# Altium project Placa_ADA.PrjPcb
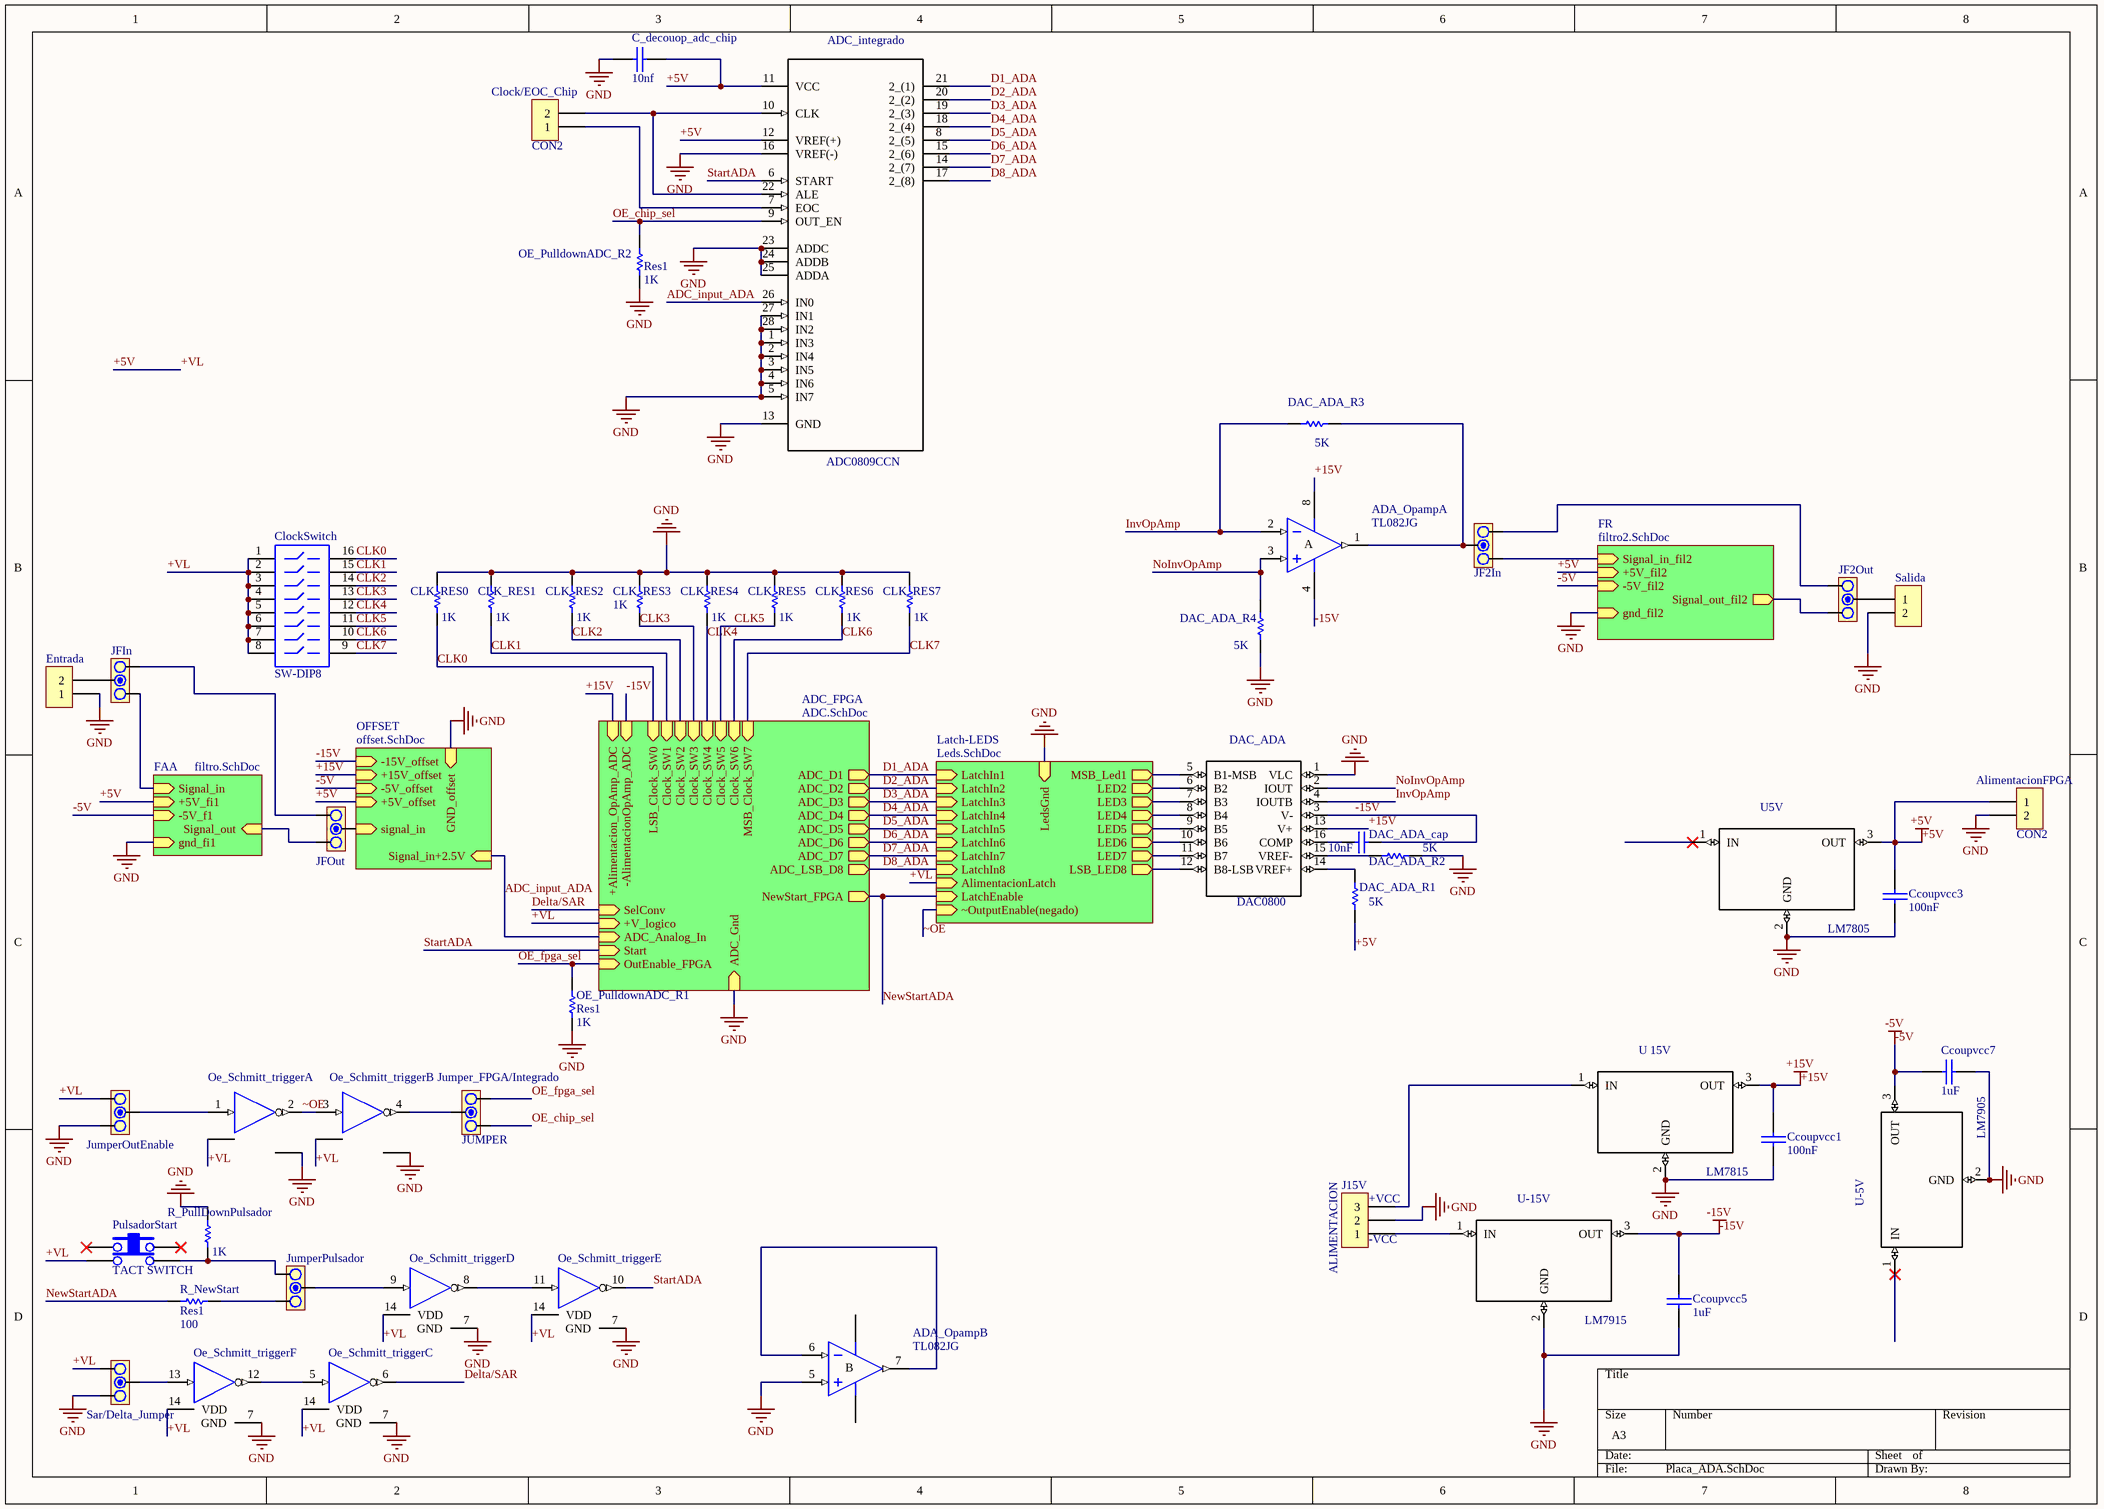
[diagram p0: Placa_ADA.SchDoc]
6 sheets, 139 parts. Net scope: hierarchical (ports join the sheet entries above them; power ports are global).
Board file: ADA.PcbDoc
Sheets:
  Placa_ADA.SchDoc
    ADC_FPGA = ADC.SchDoc
    Latch-LEDS = Leds.SchDoc
    FAA = filtro.SchDoc
    OFFSET = offset.SchDoc
    FR = filtro2.SchDoc

## Sheet Placa_ADA.SchDoc
size A3

### Parts
ADA_Opamp  TL082JG  [JG008]  (parts A,B of 2)
ADC_integrado  ADC0809CCN  [*DIP254P1524X483-28]
AlimentacionFPGA  CON2  [SIP2]
C_decouop_adc_chip  10nf  [CAP200]
Ccoupvcc1  100nF  [CAP200]
Ccoupvcc3  100nF  [CAP200]
Ccoupvcc5  1uF  [CAP200]
Ccoupvcc7  1uF  [CAP200]
CLK_RES0  value 1K  [AXIAL-0.3]  (hidden comment: Res1)
CLK_RES1  value 1K  [AXIAL-0.3]  (hidden comment: Res1)
CLK_RES2  value 1K  [AXIAL-0.3]  (hidden comment: Res1)
CLK_RES3  value 1K  [AXIAL-0.3]  (hidden comment: Res1)
CLK_RES4  value 1K  [AXIAL-0.3]  (hidden comment: Res1)
CLK_RES5  value 1K  [AXIAL-0.3]  (hidden comment: Res1)
CLK_RES6  value 1K  [AXIAL-0.3]  (hidden comment: Res1)
CLK_RES7  value 1K  [AXIAL-0.3]  (hidden comment: Res1)
Clock/EOC_Chip  CON2  [SIP2]
ClockSwitch  SW-DIP8  [DIP-16-KEY]
DAC_ADA  DAC0800  [*DIL16]
DAC_ADA_cap  value 10nF  [RAD-0.3]  (hidden comment: Cap)
DAC_ADA_R1  value 5K  [AXIAL-0.3]  (hidden comment: Res1)
DAC_ADA_R2  value 5K  [AXIAL-0.3]  (hidden comment: Res1)
DAC_ADA_R3  value 5K  [AXIAL-0.3]  (hidden comment: Res1)
DAC_ADA_R4  value 5K  [AXIAL-0.3]  (hidden comment: Res1)
Entrada  BORNERA 2  [BORNERA2]  (value not drawn)
J15V  ALIMENTACION  [BORNERA3]
JF2In  JUMPER  [JUMPER3]  (value not drawn)
JF2Out  JUMPER  [JUMPER3]  (value not drawn)
JFIn  JUMPER  [JUMPER3]  (value not drawn)
JFOut  JUMPER  [JUMPER3]  (value not drawn)
Jumper_FPGA/Integrado  JUMPER  [JUMPER3]
JumperOutEnable  JUMPER  [JUMPER3]  (value not drawn)
JumperPulsador  JUMPER  [JUMPER3]  (value not drawn)
OE_PulldownADC_R1  Res1  value 1K  [AXIAL-0.3]
OE_PulldownADC_R2  Res1  value 1K  [AXIAL-0.3]
Oe_Schmitt_trigger  MC74HC14AN  [646-06]  (value not drawn)  (parts A,B,C,D,E,F of 6)
PulsadorStart  TACT SWITCH  [TACTSWITCH]
R_NewStart  Res1  value 100  [AXIAL-0.3]
R_PullDownPulsador  value 1K  [AXIAL-0.3]  (hidden comment: Res1)
Salida  BORNERA 2  [BORNERA2]  (value not drawn)
Sar/Delta_Jumper  JUMPER  [JUMPER3]  (value not drawn)
U5V  LM7805  [*TO220]
U-5V  LM7905  [*TO220]
U-15V  LM7915  [*TO220]
U_15V  LM7815  [*TO220]

### Sub-sheets
ADC_FPGA = ADC.SchDoc: +V_logico (in), Clock_SW1 (in), Clock_SW2 (in), Clock_SW3 (in), Clock_SW4 (in), Clock_SW6 (in), LSB_Clock_SW0 (in), MSB_Clock_SW7 (in), ADC_Analog_In (in), Start (in), ADC_LSB_D8 (out), ADC_D7 (out), ADC_D6 (out), ADC_D5 (out), ADC_D4 (out), ADC_D3 (out), ADC_D2 (out), ADC_D1 (out), OutEnable_FPGA (in), ADC_Gnd (in), Clock_SW5 (in), NewStart_FPGA (out), SelConv (in), -AlimentacionOpAmp_ADC (in), +Alimentacion_OpAmp_ADC (in)
FAA = filtro.SchDoc: Signal_in (in), Signal_out (in), +5V_fi1 (in), -5V_f1 (in), gnd_fi1 (in)
FR = filtro2.SchDoc: Signal_in_fil2 (in), Signal_out_fil2 (out), +5V_fil2 (in), -5V_fil2 (in), gnd_fil2 (in)
Latch-LEDS = Leds.SchDoc: LatchIn1 (in), LatchIn2 (in), LatchIn3 (in), LatchIn4 (in), LatchIn5 (in), LatchIn6 (in), LatchIn7 (in), LatchIn8 (in), MSB_Led1 (out), LED2 (out), LED3 (out), LED4 (out), LED5 (out), LED6 (out), LED7 (out), LSB_LED8 (out), AlimentacionLatch (in), LatchEnable (in), LedsGnd (in), ~OutputEnable(negado) (in)
OFFSET = offset.SchDoc: -15V_offset (in), Signal_in+2.5V (in), +15V_offset (in), -5V_offset (in), +5V_offset (in), GND_offset (in), signal_in (in)

### Nets
+5V: ADC_integrado.11(VCC) ADC_integrado.12(VREF(+)) AlimentacionFPGA.1 C_decouop_adc_chip.2 Ccoupvcc3.1 ClockSwitch.1 ClockSwitch.2 ClockSwitch.3 ClockSwitch.4 ClockSwitch.5 ClockSwitch.6 ClockSwitch.7 ClockSwitch.8 DAC_ADA_R1.1 JumperOutEnable.3 Oe_Schmitt_trigger.14(VDD) PulsadorStart.2 Sar/Delta_Jumper.3 U5V.3(OUT) ; sheet ADC_FPGA/+V_logico, sheet Latch-LEDS/AlimentacionLatch, sheet FAA/+5V_fi1, sheet OFFSET/+5V_offset, sheet FR/+5V_fil2  [also labelled +VL, VDD]
+15V: ADA_Opamp.8(V+) Ccoupvcc1.1 DAC_ADA.13(V+) U_15V.3(OUT) ; sheet ADC_FPGA/+Alimentacion_OpAmp_ADC, sheet OFFSET/+15V_offset
-5V: Ccoupvcc7.1 U-5V.3(OUT) ; sheet FAA/-5V_f1, sheet OFFSET/-5V_offset, sheet FR/-5V_fil2
-15V: ADA_Opamp.4(V-) Ccoupvcc5.1 DAC_ADA.3(V-) DAC_ADA_cap.2 U-15V.3(OUT) ; sheet ADC_FPGA/-AlimentacionOpAmp_ADC, sheet OFFSET/-15V_offset
GND: ADA_Opamp.5(IN+) ADC_integrado.1(IN3) ADC_integrado.2(IN4) ADC_integrado.3(IN5) ADC_integrado.4(IN6) ADC_integrado.5(IN7) ADC_integrado.13(GND) ADC_integrado.16(VREF(-)) ADC_integrado.23(ADDC) ADC_integrado.24(ADDB) ADC_integrado.25(ADDA) ADC_integrado.27(IN1) ADC_integrado.28(IN2) AlimentacionFPGA.2 C_decouop_adc_chip.1 Ccoupvcc1.2 Ccoupvcc3.2 Ccoupvcc5.2 Ccoupvcc7.2 CLK_RES0.2 CLK_RES1.2 CLK_RES2.2 CLK_RES3.2 CLK_RES4.2 CLK_RES5.2 CLK_RES6.2 CLK_RES7.2 DAC_ADA.1(VLC) DAC_ADA_R2.2 DAC_ADA_R4.1 Entrada.1 J15V.2 JumperOutEnable.1 OE_PulldownADC_R1.1 OE_PulldownADC_R2.1 Oe_Schmitt_trigger.7(GND) R_PullDownPulsador.2 Salida.2 Sar/Delta_Jumper.1 U5V.2(GND) U-5V.2(GND) U-15V.2(GND) U_15V.2(GND) ; sheet ADC_FPGA/ADC_Gnd, sheet Latch-LEDS/LedsGnd, sheet FAA/gnd_fi1, sheet OFFSET/GND_offset, sheet FR/gnd_fil2  [project net GND_ADC_net]
ADC_input_ADA: ADC_integrado.26(IN0) ; sheet ADC_FPGA/ADC_Analog_In, sheet OFFSET/Signal_in+2.5V
CLK0: CLK_RES0.1 ClockSwitch.16 ; sheet ADC_FPGA/LSB_Clock_SW0
CLK1: CLK_RES1.1 ClockSwitch.15 ; sheet ADC_FPGA/Clock_SW1
CLK2: CLK_RES2.1 ClockSwitch.14 ; sheet ADC_FPGA/Clock_SW2
CLK3: CLK_RES3.1 ClockSwitch.13 ; sheet ADC_FPGA/Clock_SW3
CLK4: CLK_RES4.1 ClockSwitch.12 ; sheet ADC_FPGA/Clock_SW4
CLK5: CLK_RES5.1 ClockSwitch.11 ; sheet ADC_FPGA/Clock_SW5
CLK6: CLK_RES6.1 ClockSwitch.10 ; sheet ADC_FPGA/Clock_SW6
CLK7: CLK_RES7.1 ClockSwitch.9 ; sheet ADC_FPGA/MSB_Clock_SW7
D1_ADA: ADC_integrado.21(2_(1)) ; sheet ADC_FPGA/ADC_D1, sheet Latch-LEDS/LatchIn1
D2_ADA: ADC_integrado.20(2_(2)) ; sheet ADC_FPGA/ADC_D2, sheet Latch-LEDS/LatchIn2
D3_ADA: ADC_integrado.19(2_(3)) ; sheet ADC_FPGA/ADC_D3, sheet Latch-LEDS/LatchIn3
D4_ADA: ADC_integrado.18(2_(4)) ; sheet ADC_FPGA/ADC_D4, sheet Latch-LEDS/LatchIn4
D5_ADA: ADC_integrado.8(2_(5)) ; sheet ADC_FPGA/ADC_D5, sheet Latch-LEDS/LatchIn5
D6_ADA: ADC_integrado.15(2_(6)) ; sheet ADC_FPGA/ADC_D6, sheet Latch-LEDS/LatchIn6
D7_ADA: ADC_integrado.14(2_(7)) ; sheet ADC_FPGA/ADC_D7, sheet Latch-LEDS/LatchIn7
D8_ADA: ADC_integrado.17(2_(8)) ; sheet ADC_FPGA/ADC_LSB_D8, sheet Latch-LEDS/LatchIn8
Delta/SAR: Oe_Schmitt_trigger.6(~{OUT}) ; sheet ADC_FPGA/SelConv
InvOpAmp: ADA_Opamp.2(IN-) DAC_ADA.4(IOUTB) DAC_ADA_R3.1
L1: DAC_ADA.5(B1-MSB) ; sheet Latch-LEDS/MSB_Led1
L2: DAC_ADA.6(B2) ; sheet Latch-LEDS/LED2
L3: DAC_ADA.7(B3) ; sheet Latch-LEDS/LED3
L4: DAC_ADA.8(B4) ; sheet Latch-LEDS/LED4
L5: DAC_ADA.9(B5) ; sheet Latch-LEDS/LED5
L6: DAC_ADA.10(B6) ; sheet Latch-LEDS/LED6
L7: DAC_ADA.11(B7) ; sheet Latch-LEDS/LED7
L8: DAC_ADA.12(B8-LSB) ; sheet Latch-LEDS/LSB_LED8
NewStartADA: R_NewStart.1 ; sheet ADC_FPGA/NewStart_FPGA, sheet Latch-LEDS/LatchEnable
NoInvOpAmp: ADA_Opamp.3(IN+) DAC_ADA.2(IOUT) DAC_ADA_R4.2
OE_chip_sel: ADC_integrado.9(OUT_EN) Jumper_FPGA/Integrado.3 OE_PulldownADC_R2.2
OE_fpga_sel: Jumper_FPGA/Integrado.1 OE_PulldownADC_R1.2 ; sheet ADC_FPGA/OutEnable_FPGA
StartADA: ADC_integrado.6(START) Oe_Schmitt_trigger.10(~{OUT}) ; sheet ADC_FPGA/Start
~OE: Oe_Schmitt_trigger.2(~{OUT}) Oe_Schmitt_trigger.3(IN) ; sheet Latch-LEDS/~OutputEnable(negado)  [project net OE_negado]
NetADA_Opamp_1: ADA_Opamp.1(OUT) DAC_ADA_R3.2 JF2In.2
NetADA_Opamp_6: ADA_Opamp.6(IN-) ADA_Opamp.7(OUT)
NetADC_integrado_7: ADC_integrado.7(EOC) Clock/EOC_Chip.1
NetADC_integrado_10: ADC_integrado.10(CLK) ADC_integrado.22(ALE) Clock/EOC_Chip.2
NetDAC_ADA_14: DAC_ADA.14(VREF+) DAC_ADA_R1.2
NetDAC_ADA_15: DAC_ADA.15(VREF-) DAC_ADA_R2.1
NetDAC_ADA_16: DAC_ADA.16(COMP) DAC_ADA_cap.1
NetEntrada_2: Entrada.2 JFIn.2
Netfiltro2_5: JF2Out.1 ; sheet FR/Signal_out_fil2
Netfiltro2_8: JF2In.3 ; sheet FR/Signal_in_fil2
NetJ15V_1: J15V.1 U-15V.1(IN)
NetJ15V_3: J15V.3 U_15V.1(IN)
NetJF2In_1: JF2In.1 JF2Out.3
NetJF2Out_2: JF2Out.2 Salida.1
NetJFIn_1: JFIn.1 JFOut.3
NetJFIn_3: JFIn.3 ; sheet FAA/Signal_in
NetJFOut_1: JFOut.1 ; sheet FAA/Signal_out
NetJFOut_2: JFOut.2 ; sheet OFFSET/signal_in
NetJumper_FPGA/Integrado_2: Jumper_FPGA/Integrado.2 Oe_Schmitt_trigger.4(~{OUT})
NetJumperOutEnable_2: JumperOutEnable.2 Oe_Schmitt_trigger.1(IN)
NetJumperPulsador_1: JumperPulsador.1 R_NewStart.2
NetJumperPulsador_2: JumperPulsador.2 Oe_Schmitt_trigger.9(IN)
NetJumperPulsador_3: JumperPulsador.3 PulsadorStart.4 R_PullDownPulsador.1
NetOe_Schmitt_trigger_5: Oe_Schmitt_trigger.5(IN) Oe_Schmitt_trigger.12(~{OUT})
NetOe_Schmitt_trigger_8: Oe_Schmitt_trigger.8(~{OUT}) Oe_Schmitt_trigger.11(IN)
NetOe_Schmitt_trigger_13: Oe_Schmitt_trigger.13(IN) Sar/Delta_Jumper.2

Not connected (* = marked no-connect by the designer): PulsadorStart 1* 3*; U5V 1(IN)*; U-5V 1(IN)*

### Notes on the sheet
- (near J15V) +VCC
- (near J15V) -VCC
- (in symbol TL082JG, part A) A
- (in symbol TL082JG, part B) B

### Library data of the parts
ADA_Opamp = TL082JG: JFET-Input Operational Amplifier; Published: 16-Jan-2001; LatestRevisionDate: 04-Mar-2005; LatestRevisionNote: Stylized 3D Model Added.; DatasheetVersion: Feb-1999; PackageVersion: Jan-1995; PackageReference: JG008; Publisher: Altium Limited; PackageDescription: DIP; 8 Leads; Row Spacing 7.62 mm; Pitch 2.54 mm; ComponentLink1Description: Manufacturer Link; ComponentLink1URL: http://www.ti.com/; ComponentLink2Description: Datasheet; ComponentLink2URL: http://www-s.ti.com/sc/ds/tl082.pdf
ADC_integrado = ADC0809CCN: 8-bit Microprocessor Compatible A/D Converters With 8-Channel Multiplexer 28-PDIP -40 to 85; MP: ADC0809CCN/NOPB; MF: Texas Instruments; Availability: Unavailable; SnapEDA_Link: https://www.snapeda.com/parts/ADC0809CCN/NOPB/Texas%20Instruments/view-part/?ref=snap; Price: None; Package: DIP-28 Texas Instruments; Value: *
C_decouop_adc_chip Ccoupvcc1 Ccoupvcc3 Ccoupvcc5 Ccoupvcc7 = CAP
CLK_RES0-CLK_RES7 DAC_ADA_R1-DAC_ADA_R4 OE_PulldownADC_R1 OE_PulldownADC_R2 R_NewStart R_PullDownPulsador = Res1: Resistor; Published: 8-Jun-2000; LatestRevisionDate: 17-Jul-2002; LatestRevisionNote: Re-released for DXP Platform.; PackageReference: AXIAL-0.3; Publisher: Altium Limited; PackageDescription: Axial Device, Thru-Hole; 2 Leads; 0.3 in Pin Spacing
ClockSwitch = SW-DIP8: 4009 Series DIP Switch, Raised actuator; Published: 24-Mar-1999; LatestRevisionDate: 17-Dec-2003; LatestRevisionNote: PCB Footprint replaced.; PackageReference: DIP-16-KEY; Publisher: Altium Limited; PackageDescription: DIP; 16 Leads; Row Spacing 7.62 mm; Pitch 2.54 mm; ComponentLink1Description: Manufacturer Link; ComponentLink1URL: http://www.oupiin.com/prodindx.html#Headers
DAC_ADA = DAC0800: MF: Texas Instruments; SnapEDA_Link: https://www.snapeda.com/parts/DAC0800/Texas%20Instruments/view-part/?ref=snap; MP: DAC0800; Package: SOIC-16 Texas Instruments; Digi-Key_Part_Number: DAC0800LCN/NOPB-ND; Digi-Key_Purchase_URL: https://www.digikey.com.ar/product-detail/en/texas-instruments/DAC0800LCN-NOPB/DAC0800LCN-NOPB-ND/4652?utm_source=snapeda&utm_medium=aggregator&utm_campaign=symbol; Value: *
DAC_ADA_cap = Cap: Capacitor; Published: 8-Jun-2000; LatestRevisionDate: 17-Jul-2002; LatestRevisionNote: Re-released for DXP Platform.; PackageReference: RAD-0.3; Publisher: Altium Limited; PackageDescription: Radial Cap, Thru-Hole; 2 Leads; 0.3 in Pin Spacing
J15V = BORNERA 3
JF2In JF2Out JFIn JFOut Jumper_FPGA/Integrado JumperOutEnable JumperPulsador Sar/Delta_Jumper = JUMPER3
Oe_Schmitt_trigger = MC74HC14AN: Hex Schmitt-Trigger Inverter; Published: 15-Apr-2002; DatasheetVersion: Mar-2000; PackageVersion: 1995; PackageReference: 646-06; Publisher: Altium Limited; PackageDescription: DIP; 14 Leads; Row Spacing 7.62 mm; Pitch 2.54 mm; ComponentLink1Description: Manufacturer Link; ComponentLink1URL: http://www.onsemi.com/; ComponentLink2Description: Datasheet; ComponentLink2URL: http://www.onsemi.com/pub/Collateral/MC74HC14A-D.PDF
U5V U-5V U-15V U_15V = LM7805: MF: Texas Instruments; SnapEDA_Link: https://www.snapeda.com/parts/LM7805/Texas%20Instruments/view-part/?ref=snap; MP: LM7805; Availability: Unavailable; Package: TO-220 Texas Instruments; Price: None; Value: *

## Sheet ADC.SchDoc
size A4
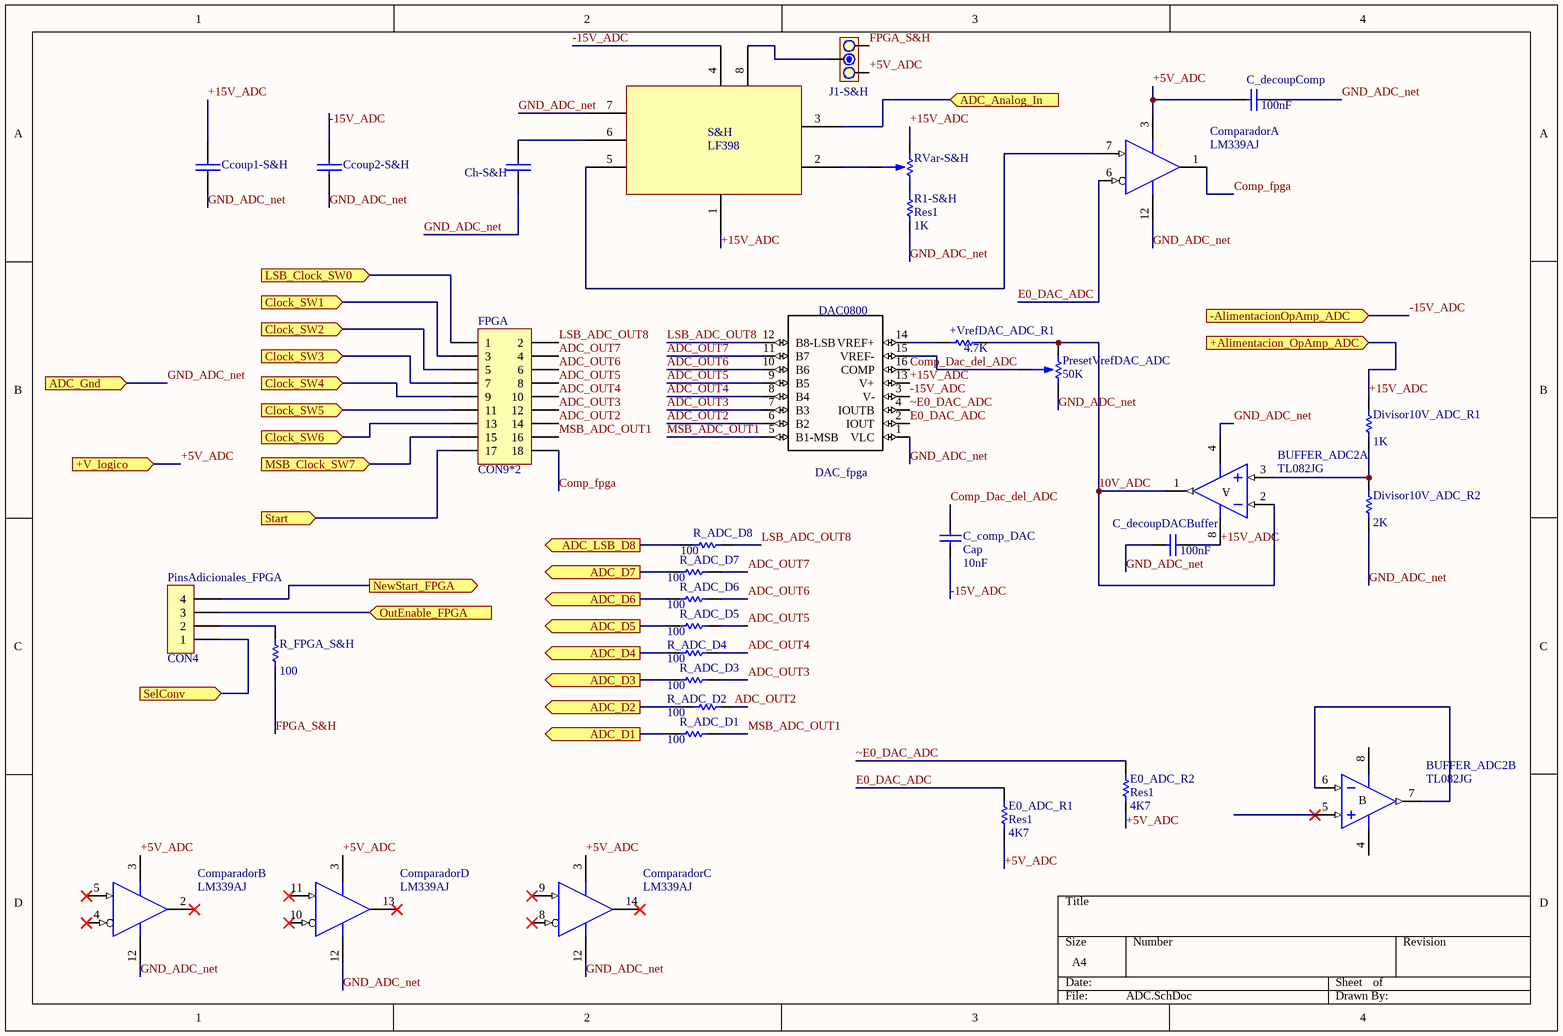
[diagram p1: ADC.SchDoc]

### Parts
+VrefDAC_ADC_R1  value 4.7K  [AXIAL-0.3]  (hidden comment: Res1)
BUFFER_ADC2  TL082JG  [JG008]  (parts A,B of 2)
C_comp_DAC  Cap  value 10nF  [RAD-0.3]
C_decoupComp  value 100nF  [RAD-0.3]  (hidden comment: Cap)
C_decoupDACBuffer  value 100nF  [RAD-0.3]  (hidden comment: Cap)
Ccoup1-S&H  CAP  [CAP200]  (value not drawn)
Ccoup2-S&H  CAP  [CAP200]  (value not drawn)
Ch-S&H  CAP  [CAP200]  (value not drawn)
Comparador  LM339AJ  [J014]  (parts A,B,C,D of 4)
DAC_fpga  DAC0800  [*DIL16]
Divisor10V_ADC_R1  value 1K  [AXIAL-0.3]  (hidden comment: Res1)
Divisor10V_ADC_R2  value 2K  [AXIAL-0.3]  (hidden comment: Res1)
E0_ADC_R1  Res1  value 4K7  [AXIAL-0.3]
E0_ADC_R2  Res1  value 4K7  [AXIAL-0.3]
FPGA  CON9*2  [SIP9*2]
J1-S&H  JUMPER  [JUMPER3]  (value not drawn)
PinsAdicionales_FPGA  CON4  [SIP4]
PresetVrefDAC_ADC  50K  [PRESET V]
R1-S&H  Res1  value 1K  [AXIAL-0.3]
R_ADC_D1  value 100  [AXIAL-0.3]  (hidden comment: Res1)
R_ADC_D2  value 100  [AXIAL-0.3]  (hidden comment: Res1)
R_ADC_D3  value 100  [AXIAL-0.3]  (hidden comment: Res1)
R_ADC_D4  value 100  [AXIAL-0.3]  (hidden comment: Res1)
R_ADC_D5  value 100  [AXIAL-0.3]  (hidden comment: Res1)
R_ADC_D6  value 100  [AXIAL-0.3]  (hidden comment: Res1)
R_ADC_D7  value 100  [AXIAL-0.3]  (hidden comment: Res1)
R_ADC_D8  value 100  [AXIAL-0.3]  (hidden comment: Res1)
R_FPGA_S&H  value 100  [AXIAL-0.3]  (hidden comment: Res1)
RVar-S&H  PRESET  [PRESET V]  (value not drawn)
S&H  LF398  [DIP8]

### Ports
+Alimentacion_OpAmp_ADC (in), +V_logico (in), -AlimentacionOpAmp_ADC (in), ADC_Analog_In (in), ADC_D1 (out), ADC_D2 (out), ADC_D3 (out), ADC_D4 (out), ADC_D5 (out), ADC_D6 (out), ADC_D7 (out), ADC_Gnd (in), ADC_LSB_D8 (out), Clock_SW1 (in), Clock_SW2 (in), Clock_SW3 (in), Clock_SW4 (in), Clock_SW5 (in), Clock_SW6 (in), LSB_Clock_SW0 (in), MSB_Clock_SW7 (in), NewStart_FPGA (out), OutEnable_FPGA (in), SelConv (in), Start (in)

### Nets
+5V_ADC: C_decoupComp.1 Comparador.3(VCC) E0_ADC_R1.1 E0_ADC_R2.1 J1-S&H.3 ; port +V_logico  [project net +5V]
+15V_ADC: BUFFER_ADC2.8(V+) C_decoupDACBuffer.2 Ccoup1-S&H.1 DAC_fpga.13(V+) Divisor10V_ADC_R1.2 RVar-S&H.3 S&H.1(GND) ; port +Alimentacion_OpAmp_ADC  [project net +15V]
-15V_ADC: C_comp_DAC.1 Ccoup2-S&H.1 DAC_fpga.3(V-) S&H.4(RESET) ; port -AlimentacionOpAmp_ADC  [project net -15V]
GND_ADC_net: BUFFER_ADC2.4(V-) C_decoupComp.2 C_decoupDACBuffer.1 Ccoup1-S&H.2 Ccoup2-S&H.2 Ch-S&H.2 Comparador.12(GND) DAC_fpga.1(VLC) Divisor10V_ADC_R2.1 PresetVrefDAC_ADC.1 R1-S&H.1 S&H.7(DISCHARGE) ; port ADC_Gnd
10V_ADC: +VrefDAC_ADC_R1.2 BUFFER_ADC2.1(OUT) BUFFER_ADC2.2(IN-) PresetVrefDAC_ADC.3
ADC_input_ADA: S&H.3(OUT) ; port ADC_Analog_In
ADC_OUT2: DAC_fpga.6(B2) FPGA.14 R_ADC_D2.2
ADC_OUT3: DAC_fpga.7(B3) FPGA.12 R_ADC_D3.2
ADC_OUT4: DAC_fpga.8(B4) FPGA.10 R_ADC_D4.2
ADC_OUT5: DAC_fpga.9(B5) FPGA.8 R_ADC_D5.2
ADC_OUT6: DAC_fpga.10(B6) FPGA.6 R_ADC_D6.2
ADC_OUT7: DAC_fpga.11(B7) FPGA.4 R_ADC_D7.2
CLK0: FPGA.1 ; port LSB_Clock_SW0
CLK1: FPGA.3 ; port Clock_SW1
CLK2: FPGA.5 ; port Clock_SW2
CLK3: FPGA.7 ; port Clock_SW3
CLK4: FPGA.9 ; port Clock_SW4
CLK5: FPGA.11 ; port Clock_SW5
CLK6: FPGA.13 ; port Clock_SW6
CLK7: FPGA.15 ; port MSB_Clock_SW7
Comp_Dac_del_ADC: C_comp_DAC.2 DAC_fpga.16(COMP)
Comp_fpga: Comparador.1(OUT) FPGA.18
D1_ADA: R_ADC_D1.1 ; port ADC_D1
D2_ADA: R_ADC_D2.1 ; port ADC_D2
D3_ADA: R_ADC_D3.1 ; port ADC_D3
D4_ADA: R_ADC_D4.1 ; port ADC_D4
D5_ADA: R_ADC_D5.1 ; port ADC_D5
D6_ADA: R_ADC_D6.1 ; port ADC_D6
D7_ADA: R_ADC_D7.1 ; port ADC_D7
D8_ADA: R_ADC_D8.1 ; port ADC_LSB_D8
Delta/SAR: PinsAdicionales_FPGA.1 ; port SelConv
E0_DAC_ADC: Comparador.6(IN-) DAC_fpga.2(IOUT) E0_ADC_R1.2
FPGA_S&H: J1-S&H.1 R_FPGA_S&H.1
LSB_ADC_OUT8: DAC_fpga.12(B8-LSB) FPGA.2 R_ADC_D8.2
MSB_ADC_OUT1: DAC_fpga.5(B1-MSB) FPGA.16 R_ADC_D1.2
NewStartADA: PinsAdicionales_FPGA.4 ; port NewStart_FPGA
OE_fpga_sel: PinsAdicionales_FPGA.3 ; port OutEnable_FPGA
StartADA: FPGA.17 ; port Start
~E0_DAC_ADC: DAC_fpga.4(IOUTB) E0_ADC_R2.2
Net+VrefDAC_ADC_R1_1: +VrefDAC_ADC_R1.1 DAC_fpga.14(VREF+)
NetBUFFER_ADC2_3: BUFFER_ADC2.3(IN+) Divisor10V_ADC_R1.1 Divisor10V_ADC_R2.2
NetBUFFER_ADC2_6: BUFFER_ADC2.6(IN-) BUFFER_ADC2.7(OUT)
NetCh-S&H_1: Ch-S&H.1 S&H.6(THRESHOLD)
NetComparador_7: Comparador.7(IN+) S&H.5(C_VOLTAJE)
NetDAC_fpga_15: DAC_fpga.15(VREF-) PresetVrefDAC_ADC.2
NetJ1-S&H_2: J1-S&H.2 S&H.8(VCC)
NetPinsAdicionales_FPGA_2: PinsAdicionales_FPGA.2 R_FPGA_S&H.2
NetR1-S&H_2: R1-S&H.2 RVar-S&H.1
NetRVar-S&H_2: RVar-S&H.2 S&H.2(TRIGGER)

Not connected (* = marked no-connect by the designer): BUFFER_ADC2 5(IN+)*; Comparador 2(OUT)* 4(IN-)* 5(IN+)* 8(IN-)* 9(IN+)* 10(IN-)* 11(IN+)* 13(OUT)* 14(OUT)*

### Notes on the sheet
- (in symbol TL082JG, part A) A
- (in symbol TL082JG, part B) B

### Library data of the parts
+VrefDAC_ADC_R1 Divisor10V_ADC_R1 Divisor10V_ADC_R2 E0_ADC_R1 E0_ADC_R2 R1-S&H R_ADC_D1-R_ADC_D8 R_FPGA_S&H = Res1: Resistor; Published: 8-Jun-2000; LatestRevisionDate: 17-Jul-2002; LatestRevisionNote: Re-released for DXP Platform.; PackageReference: AXIAL-0.3; Publisher: Altium Limited; PackageDescription: Axial Device, Thru-Hole; 2 Leads; 0.3 in Pin Spacing
BUFFER_ADC2 = TL082JG: JFET-Input Operational Amplifier; Published: 16-Jan-2001; LatestRevisionDate: 04-Mar-2005; LatestRevisionNote: Stylized 3D Model Added.; DatasheetVersion: Feb-1999; PackageVersion: Jan-1995; PackageReference: JG008; Publisher: Altium Limited; PackageDescription: DIP; 8 Leads; Row Spacing 7.62 mm; Pitch 2.54 mm; ComponentLink1Description: Manufacturer Link; ComponentLink1URL: http://www.ti.com/; ComponentLink2Description: Datasheet; ComponentLink2URL: http://www-s.ti.com/sc/ds/tl082.pdf
C_comp_DAC C_decoupComp C_decoupDACBuffer = Cap: Capacitor; Published: 8-Jun-2000; LatestRevisionDate: 17-Jul-2002; LatestRevisionNote: Re-released for DXP Platform.; PackageReference: RAD-0.3; Publisher: Altium Limited; PackageDescription: Radial Cap, Thru-Hole; 2 Leads; 0.3 in Pin Spacing
Comparador = LM339AJ: Quad Differential Comparator; Published: 15-Apr-2002; LatestRevisionDate: 04-Mar-2005; LatestRevisionNote: Stylized 3D Model Added.; DatasheetVersion: Apr-1988; PackageVersion: Jun-1999; PackageReference: J014; Publisher: Altium Limited; PackageDescription: DIP; 14 Leads; Row Spacing 7.62 mm; Pitch 2.54 mm; ComponentLink1Description: Manufacturer Link; ComponentLink1URL: http://www.ti.com/; ComponentLink2Description: Datasheet; ComponentLink2URL: http://www-s.ti.com/sc/ds/lm139a.pdf
DAC_fpga = DAC0800: MF: Texas Instruments; SnapEDA_Link: https://www.snapeda.com/parts/DAC0800/Texas%20Instruments/view-part/?ref=snap; MP: DAC0800; Package: SOIC-16 Texas Instruments; Digi-Key_Part_Number: DAC0800LCN/NOPB-ND; Digi-Key_Purchase_URL: https://www.digikey.com.ar/product-detail/en/texas-instruments/DAC0800LCN-NOPB/DAC0800LCN-NOPB-ND/4652?utm_source=snapeda&utm_medium=aggregator&utm_campaign=symbol; Value: *
J1-S&H = JUMPER3
PresetVrefDAC_ADC = PRESET
S&H = LM555: Sample and Hold Amplifier

## Sheet Leds.SchDoc
size A4
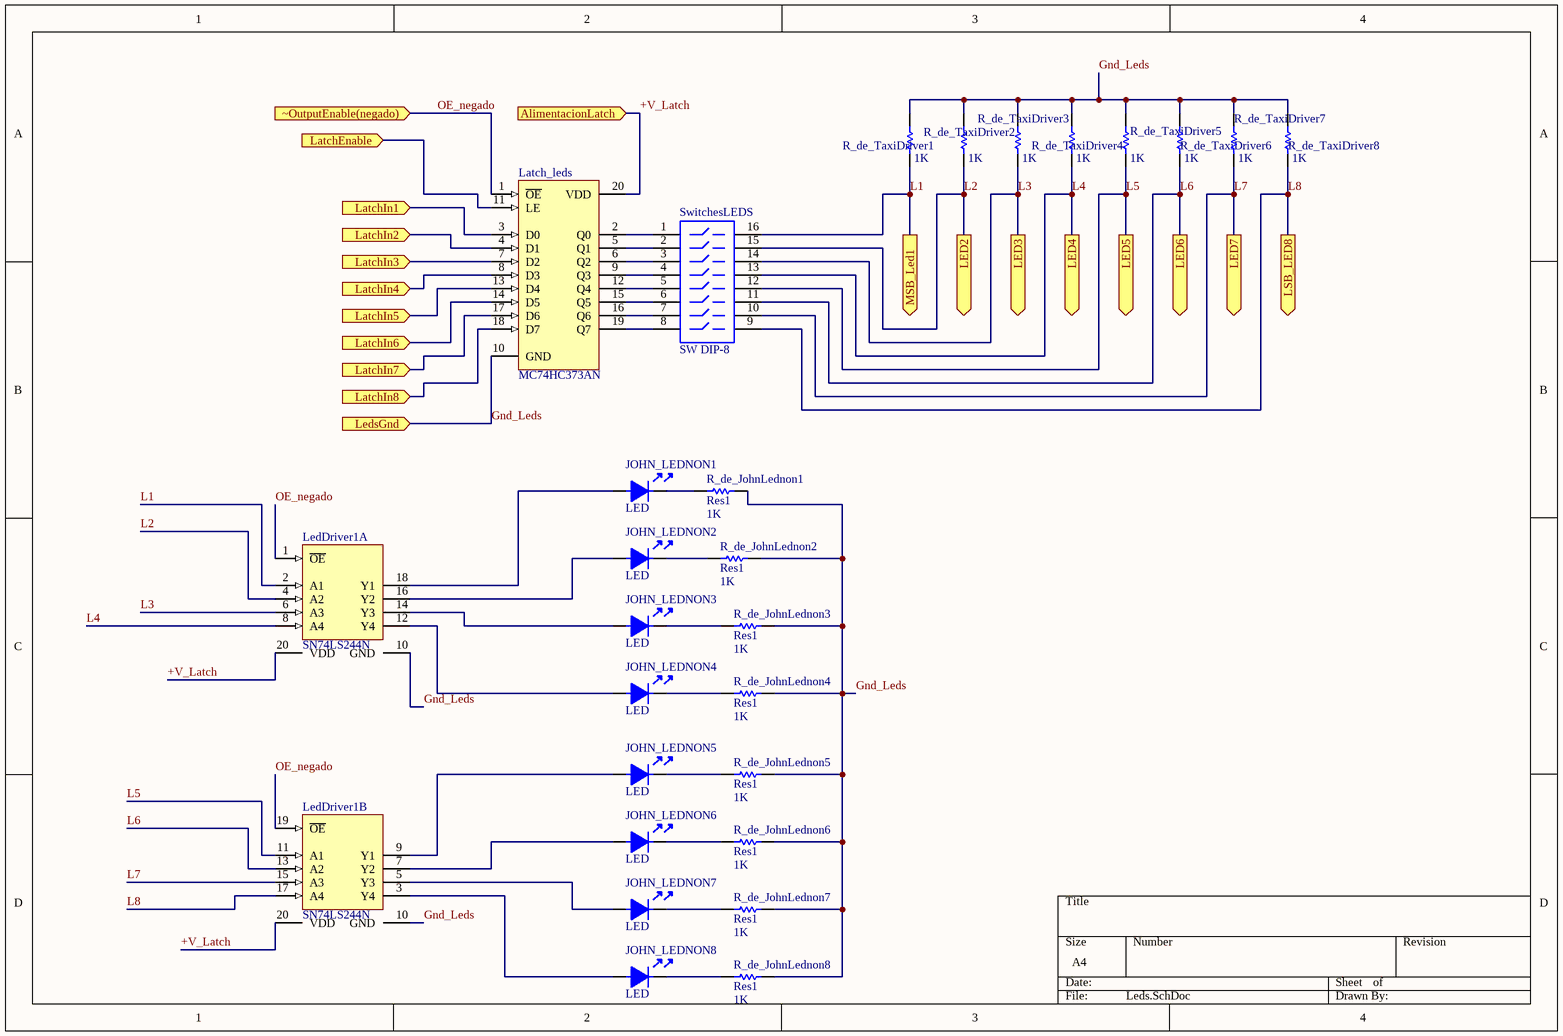
[diagram p2: Leds.SchDoc]

### Parts
JOHN_LEDNON1  LED  [LED3]
JOHN_LEDNON2  LED  [LED3]
JOHN_LEDNON3  LED  [LED3]
JOHN_LEDNON4  LED  [LED3]
JOHN_LEDNON5  LED  [LED3]
JOHN_LEDNON6  LED  [LED3]
JOHN_LEDNON7  LED  [LED3]
JOHN_LEDNON8  LED  [LED3]
Latch_leds  MC74HC373AN  [738-03]
LedDriver1  SN74LS244N  [738-03]  (parts A,B of 2)
R_de_JohnLednon1  Res1  value 1K  [AXIAL-0.3]
R_de_JohnLednon2  Res1  value 1K  [AXIAL-0.3]
R_de_JohnLednon3  Res1  value 1K  [AXIAL-0.3]
R_de_JohnLednon4  Res1  value 1K  [AXIAL-0.3]
R_de_JohnLednon5  Res1  value 1K  [AXIAL-0.3]
R_de_JohnLednon6  Res1  value 1K  [AXIAL-0.3]
R_de_JohnLednon7  Res1  value 1K  [AXIAL-0.3]
R_de_JohnLednon8  Res1  value 1K  [AXIAL-0.3]
R_de_TaxiDriver1  value 1K  [AXIAL-0.3]  (hidden comment: Res1)
R_de_TaxiDriver2  value 1K  [AXIAL-0.3]  (hidden comment: Res1)
R_de_TaxiDriver3  value 1K  [AXIAL-0.3]  (hidden comment: Res1)
R_de_TaxiDriver4  value 1K  [AXIAL-0.3]  (hidden comment: Res1)
R_de_TaxiDriver5  value 1K  [AXIAL-0.3]  (hidden comment: Res1)
R_de_TaxiDriver6  value 1K  [AXIAL-0.3]  (hidden comment: Res1)
R_de_TaxiDriver7  value 1K  [AXIAL-0.3]  (hidden comment: Res1)
R_de_TaxiDriver8  value 1K  [AXIAL-0.3]  (hidden comment: Res1)
SwitchesLEDS  SW DIP-8  [DIP-16-KEY]

### Ports
AlimentacionLatch (in), LatchEnable (in), LatchIn1 (in), LatchIn2 (in), LatchIn3 (in), LatchIn4 (in), LatchIn5 (in), LatchIn6 (in), LatchIn7 (in), LatchIn8 (in), LED2 (out), LED3 (out), LED4 (out), LED5 (out), LED6 (out), LED7 (out), LedsGnd (in), LSB_LED8 (out), MSB_Led1 (out), ~OutputEnable(negado) (in)

### Nets
+V_Latch: Latch_leds.20(VDD) LedDriver1.20(VDD) ; port AlimentacionLatch  [also labelled VDD]  [project net +5V]
GND: Latch_leds.10(GND) LedDriver1.10(GND) R_de_JohnLednon1.2 R_de_JohnLednon2.2 R_de_JohnLednon3.2 R_de_JohnLednon4.2 R_de_JohnLednon5.2 R_de_JohnLednon6.2 R_de_JohnLednon7.2 R_de_JohnLednon8.2 R_de_TaxiDriver1.2 R_de_TaxiDriver2.2 R_de_TaxiDriver3.2 R_de_TaxiDriver4.2 R_de_TaxiDriver5.2 R_de_TaxiDriver6.2 R_de_TaxiDriver7.2 R_de_TaxiDriver8.2 ; port LedsGnd  [also labelled Gnd_Leds]  [project net GND_ADC_net]
D1_ADA: Latch_leds.3(D0) ; port LatchIn1
D2_ADA: Latch_leds.4(D1) ; port LatchIn2
D3_ADA: Latch_leds.7(D2) ; port LatchIn3
D4_ADA: Latch_leds.8(D3) ; port LatchIn4
D5_ADA: Latch_leds.13(D4) ; port LatchIn5
D6_ADA: Latch_leds.14(D5) ; port LatchIn6
D7_ADA: Latch_leds.17(D6) ; port LatchIn7
D8_ADA: Latch_leds.18(D7) ; port LatchIn8
L1: LedDriver1.2(A1) R_de_TaxiDriver1.1 SwitchesLEDS.16 ; port MSB_Led1
L2: LedDriver1.4(A2) R_de_TaxiDriver2.1 SwitchesLEDS.15 ; port LED2
L3: LedDriver1.6(A3) R_de_TaxiDriver3.1 SwitchesLEDS.14 ; port LED3
L4: LedDriver1.8(A4) R_de_TaxiDriver4.1 SwitchesLEDS.13 ; port LED4
L5: LedDriver1.11(A1) R_de_TaxiDriver5.1 SwitchesLEDS.12 ; port LED5
L6: LedDriver1.13(A2) R_de_TaxiDriver6.1 SwitchesLEDS.11 ; port LED6
L7: LedDriver1.15(A3) R_de_TaxiDriver7.1 SwitchesLEDS.10 ; port LED7
L8: LedDriver1.17(A4) R_de_TaxiDriver8.1 SwitchesLEDS.9 ; port LSB_LED8
NewStartADA: Latch_leds.11(LE) ; port LatchEnable
OE_negado: Latch_leds.1(~{OE}) LedDriver1.1(~{OE}) LedDriver1.19(~{OE}) ; port ~OutputEnable(negado)
NetJOHN_LEDNON1_1: JOHN_LEDNON1.1 LedDriver1.18(Y1)
NetJOHN_LEDNON1_2: JOHN_LEDNON1.2 R_de_JohnLednon1.1
NetJOHN_LEDNON2_1: JOHN_LEDNON2.1 LedDriver1.16(Y2)
NetJOHN_LEDNON2_2: JOHN_LEDNON2.2 R_de_JohnLednon2.1
NetJOHN_LEDNON3_1: JOHN_LEDNON3.1 LedDriver1.14(Y3)
NetJOHN_LEDNON3_2: JOHN_LEDNON3.2 R_de_JohnLednon3.1
NetJOHN_LEDNON4_1: JOHN_LEDNON4.1 LedDriver1.12(Y4)
NetJOHN_LEDNON4_2: JOHN_LEDNON4.2 R_de_JohnLednon4.1
NetJOHN_LEDNON5_1: JOHN_LEDNON5.1 LedDriver1.9(Y1)
NetJOHN_LEDNON5_2: JOHN_LEDNON5.2 R_de_JohnLednon5.1
NetJOHN_LEDNON6_1: JOHN_LEDNON6.1 LedDriver1.7(Y2)
NetJOHN_LEDNON6_2: JOHN_LEDNON6.2 R_de_JohnLednon6.1
NetJOHN_LEDNON7_1: JOHN_LEDNON7.1 LedDriver1.5(Y3)
NetJOHN_LEDNON7_2: JOHN_LEDNON7.2 R_de_JohnLednon7.1
NetJOHN_LEDNON8_1: JOHN_LEDNON8.1 LedDriver1.3(Y4)
NetJOHN_LEDNON8_2: JOHN_LEDNON8.2 R_de_JohnLednon8.1
NetLatch_leds_2: Latch_leds.2(Q0) SwitchesLEDS.1
NetLatch_leds_5: Latch_leds.5(Q1) SwitchesLEDS.2
NetLatch_leds_6: Latch_leds.6(Q2) SwitchesLEDS.3
NetLatch_leds_9: Latch_leds.9(Q3) SwitchesLEDS.4
NetLatch_leds_12: Latch_leds.12(Q4) SwitchesLEDS.5
NetLatch_leds_15: Latch_leds.15(Q5) SwitchesLEDS.6
NetLatch_leds_16: Latch_leds.16(Q6) SwitchesLEDS.7
NetLatch_leds_19: Latch_leds.19(Q7) SwitchesLEDS.8

### Library data of the parts
Latch_leds = MC74HC373AN: Octal 3-State Non-Inverting Transparent Latch; Published: 15-Apr-2002; DatasheetVersion: Mar-2000; PackageVersion: 1996; PackageReference: 738-03; Publisher: Altium Limited; PackageDescription: DIP; 20 Leads; Row Spacing 7.62 mm; Pitch 2.54 mm; Code_JEDEC: MS-001-AD; ComponentLink1Description: Manufacturer Link; ComponentLink1URL: http://www.onsemi.com/; ComponentLink2Description: Datasheet; ComponentLink2URL: http://www.onsemi.com/pub/Collateral/MC74HC373A-D.PDF
LedDriver1 = SN74LS244N: Octal Buffer/Line Driver with 3-State Outputs; Published: 15-Apr-2002; DatasheetVersion: Rev. 6, Dec-1999; PackageVersion: 1996; PackageReference: 738-03; Publisher: Altium Limited; PackageDescription: DIP; 20 Leads; Row Spacing 7.62 mm; Pitch 2.54 mm; Code_JEDEC: MS-001-AD; ComponentLink1Description: Manufacturer Link; ComponentLink1URL: http://www.onsemi.com/; ComponentLink2Description: Datasheet; ComponentLink2URL: http://www.onsemi.com/pub/Collateral/SN74LS240-D.PDF
R_de_JohnLednon1-R_de_JohnLednon8 R_de_TaxiDriver1-R_de_TaxiDriver8 = Res1: Resistor; Published: 8-Jun-2000; LatestRevisionDate: 17-Jul-2002; LatestRevisionNote: Re-released for DXP Platform.; PackageReference: AXIAL-0.3; Publisher: Altium Limited; PackageDescription: Axial Device, Thru-Hole; 2 Leads; 0.3 in Pin Spacing
SwitchesLEDS = SW-DIP8: 4009 Series DIP Switch, Raised actuator; Published: 24-Mar-1999; LatestRevisionDate: 17-Dec-2003; LatestRevisionNote: PCB Footprint replaced.; PackageReference: DIP-16-KEY; Publisher: Altium Limited; PackageDescription: DIP; 16 Leads; Row Spacing 7.62 mm; Pitch 2.54 mm; ComponentLink1Description: Manufacturer Link; ComponentLink1URL: http://www.oupiin.com/prodindx.html#Headers

## Sheet filtro.SchDoc
size A
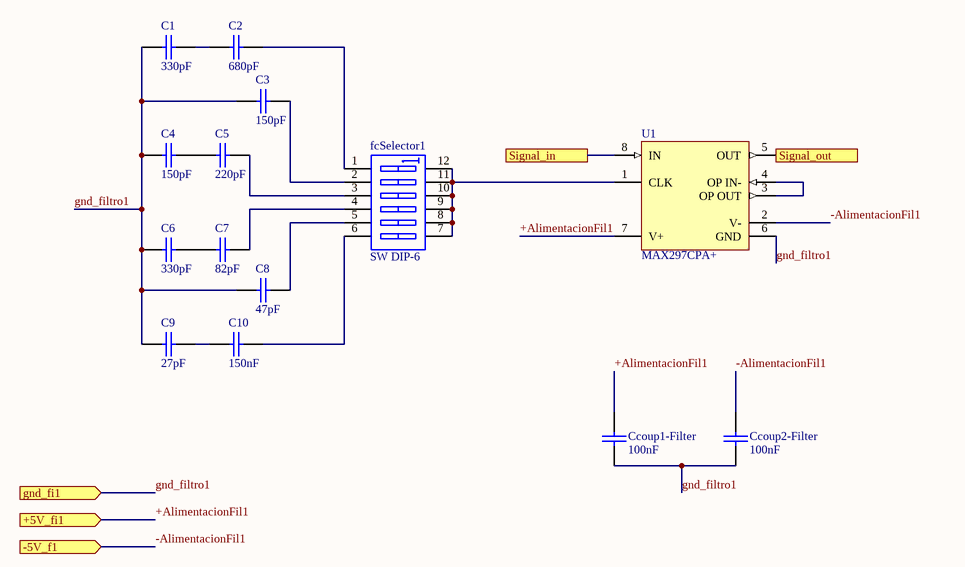
[diagram p3: filtro.SchDoc]

### Parts
C1  330pF  [CAP200]
C2  680pF  [CAP200]
C3  150pF  [CAP200]
C4  150pF  [CAP200]
C5  220pF  [CAP200]
C6  330pF  [CAP200]
C7  82pF  [CAP200]
C8  47pF  [CAP200]
C9  27pF  [CAP200]
C10  150nF  [CAP200]
Ccoup1-Filter  100nF  [CAP200]
Ccoup2-Filter  100nF  [CAP200]
fcSelector1  SW DIP-6  [DIP-12/SW]
U1  MAX297CPA+  [MAXM-P8+2]

### Ports
+5V_fi1 (in), -5V_f1 (in), gnd_fi1 (in), Signal_in, Signal_out

### Nets
+AlimentacionFil1: Ccoup1-Filter.2 U1.7(V+) ; port +5V_fi1  [project net +5V]
-AlimentacionFil1: Ccoup2-Filter.2 U1.2(V-) ; port -5V_f1  [project net -5V]
gnd_filtro1: C1.1 C3.1 C4.1 C6.1 C8.1 C9.1 Ccoup1-Filter.1 Ccoup2-Filter.1 U1.6(GND) ; port gnd_fi1  [project net GND_ADC_net]
NetC1_2: C1.2 C2.1
NetC2_2: C2.2 fcSelector1.1(A1)
NetC3_2: C3.2 fcSelector1.2(A2)
NetC4_2: C4.2 C5.1
NetC5_2: C5.2 fcSelector1.3(A3)
NetC6_2: C6.2 C7.1
NetC7_2: C7.2 fcSelector1.4(A4)
NetC8_2: C8.2 fcSelector1.5(A5)
NetC9_2: C9.2 C10.1
NetC10_2: C10.2 fcSelector1.6(A6)
NetfcSelector1_7: fcSelector1.7(B6) fcSelector1.8(B5) fcSelector1.9(B4) fcSelector1.10(B3) fcSelector1.11(B2) fcSelector1.12(B1) U1.1(CLK)
NetJFIn_3: U1.8(IN) ; port Signal_in
NetJFOut_1: U1.5(OUT) ; port Signal_out
NetU1_3: U1.3(OP_OUT) U1.4(OP_IN-)

### Library data of the parts
C1-C10 Ccoup1-Filter Ccoup2-Filter = CAP
fcSelector1 = SW DIP-6: DIP Switch, 6 Position, SPST; Published: 24-Mar-1999; LatestRevisionDate: 17-Jul-2002; LatestRevisionNote: Re-released for DXP Platform.; PackageReference: DIP-12/SW; Publisher: Altium Limited; PackageDescription: DIP Switch; 12 Leads
U1 = MAX297CPA+: 8th-Order Switched Capacitor Lowpass Filter, Elliptic, 1.5 Transition Ratio, 0 to 70 degC, 8-Pin DIP (P8+2), Pb-Free; Generic Part Number: MAX297; Filter Sections: 1; Order Per Filter Section: 8; Program Method: Clock; DatasheetVersion: Rev. 2; PackageVersion: Rev. E, 04/2011; PackageReference: P8+2; PackageDescription: 8-Pin Plastic Dual-In-Line, Narrow (0.3in) (P8+2), Body 9.375 x 6.985 mm, Pitch 2.54 mm; Supplier 1: Digi-Key; Supplier Part Number 1: MAX297CPA+-ND; Supplier 2: Mouser; Supplier Part Number 2: 700-MAX297CPA; Filter Characteristic: Elliptic; Filter Class: Switched Cap; Filter Type: Lowpass; RoHS: Pb-Free; Mounting Technology: Through Hole; Code_JEDEC: MS001-XX; PartNumber: MAX297CPA+; ComponentLink1Description: Manufacturer URL; ComponentLink1URL: http://www.maximintegrated.com/; ComponentLink2Description: Datasheet; ComponentLink2URL: http://datasheets.maximintegrated.com/en/ds/MAX293-MAX297.pdf; ComponentLink3Description: Package Specification; ComponentLink3URL: http://pdfserv.maximintegrated.com/package_dwgs/21-0043.PDF

## Sheet offset.SchDoc
size A
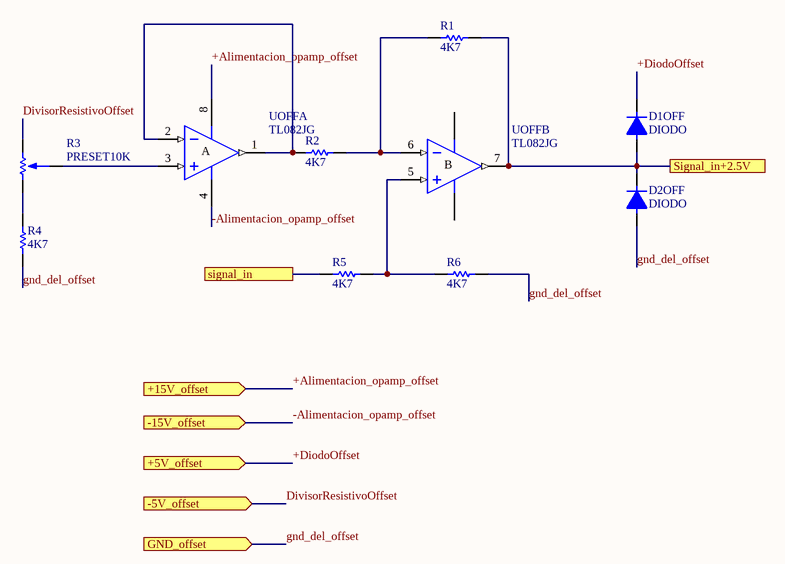
[diagram p4: offset.SchDoc]

### Parts
D1OFF  DIODO  [DO41]
D2OFF  DIODO  [DO41]
R1  4K7  [RES400]
R2  4K7  [RES400]
R3  PRESET10K  [PRESET V]
R4  4K7  [RES400]
R5  4K7  [RES400]
R6  4K7  [RES400]
UOFF  TL082JG  [JG008]  (parts A,B of 2)

### Ports
+5V_offset (in), +15V_offset (in), -5V_offset (in), -15V_offset (in), GND_offset (in), signal_in, Signal_in+2.5V

### Nets
+Alimentacion_opamp_offset: UOFF.8(V+) ; port +15V_offset  [project net +15V]
+DiodoOffset: D1OFF.2 ; port +5V_offset  [project net +5V]
-Alimentacion_opamp_offset: UOFF.4(V-) ; port -15V_offset  [project net -15V]
DivisorResistivoOffset: R3.1 ; port -5V_offset  [project net -5V]
gnd_del_offset: D2OFF.1 R4.1 R6.1 ; port GND_offset  [project net GND_ADC_net]
ADC_input_ADA: D1OFF.1 D2OFF.2 R1.1 UOFF.7(OUT) ; port Signal_in+2.5V
NetJFOut_2: R5.2 ; port signal_in
NetR1_2: R1.2 R2.1 UOFF.6(IN-)
NetR2_2: R2.2 UOFF.1(OUT) UOFF.2(IN-)
NetR3_2: R3.2 UOFF.3(IN+)
NetR3_3: R3.3 R4.2
NetR5_1: R5.1 R6.2 UOFF.5(IN+)

### Notes on the sheet
- (in symbol TL082JG, part A) A
- (in symbol TL082JG, part B) B

### Library data of the parts
R1 R2 R4-R6 = RES
R3 = PRESET
UOFF = TL082JG: JFET-Input Operational Amplifier; Published: 16-Jan-2001; LatestRevisionDate: 04-Mar-2005; LatestRevisionNote: Stylized 3D Model Added.; DatasheetVersion: Feb-1999; PackageVersion: Jan-1995; PackageReference: JG008; Publisher: Altium Limited; PackageDescription: DIP; 8 Leads; Row Spacing 7.62 mm; Pitch 2.54 mm; ComponentLink1Description: Manufacturer Link; ComponentLink1URL: http://www.ti.com/; ComponentLink2Description: Datasheet; ComponentLink2URL: http://www-s.ti.com/sc/ds/tl082.pdf

## Sheet filtro2.SchDoc
size Letter
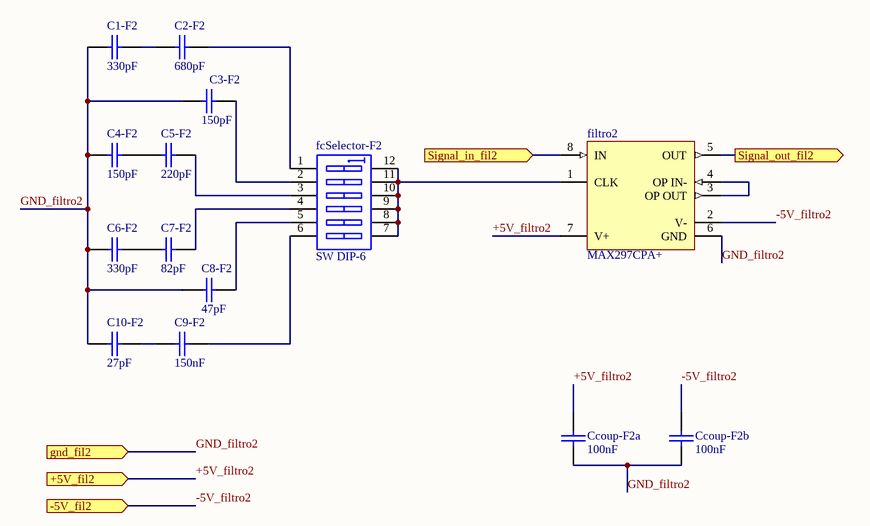
[diagram p5: filtro2.SchDoc]

### Parts
C1-F2  330pF  [CAP200]
C2-F2  680pF  [CAP200]
C3-F2  150pF  [CAP200]
C4-F2  150pF  [CAP200]
C5-F2  220pF  [CAP200]
C6-F2  330pF  [CAP200]
C7-F2  82pF  [CAP200]
C8-F2  47pF  [CAP200]
C9-F2  150nF  [CAP200]
C10-F2  27pF  [CAP200]
Ccoup-F2a  100nF  [CAP200]
Ccoup-F2b  100nF  [CAP200]
fcSelector-F2  SW DIP-6  [DIP-12/SW]
filtro2  MAX297CPA+  [MAXM-P8+2]

### Ports
+5V_fil2 (in), -5V_fil2 (in), gnd_fil2 (in), Signal_in_fil2 (in), Signal_out_fil2 (out)

### Nets
+5V_filtro2: Ccoup-F2a.2 filtro2.7(V+) ; port +5V_fil2  [project net +5V]
-5V_filtro2: Ccoup-F2b.2 filtro2.2(V-) ; port -5V_fil2  [project net -5V]
GND_filtro2: C1-F2.1 C3-F2.1 C4-F2.1 C6-F2.1 C8-F2.1 C10-F2.1 Ccoup-F2a.1 Ccoup-F2b.1 filtro2.6(GND) ; port gnd_fil2  [project net GND_ADC_net]
NetC1-F2_2: C1-F2.2 C2-F2.1
NetC2-F2_2: C2-F2.2 fcSelector-F2.1(A1)
NetC3-F2_2: C3-F2.2 fcSelector-F2.2(A2)
NetC4-F2_2: C4-F2.2 C5-F2.1
NetC5-F2_2: C5-F2.2 fcSelector-F2.3(A3)
NetC6-F2_2: C6-F2.2 C7-F2.1
NetC7-F2_2: C7-F2.2 fcSelector-F2.4(A4)
NetC8-F2_2: C8-F2.2 fcSelector-F2.5(A5)
NetC9-F2_1: C9-F2.1 C10-F2.2
NetC9-F2_2: C9-F2.2 fcSelector-F2.6(A6)
NetfcSelector-F2_7: fcSelector-F2.7(B6) fcSelector-F2.8(B5) fcSelector-F2.9(B4) fcSelector-F2.10(B3) fcSelector-F2.11(B2) fcSelector-F2.12(B1) filtro2.1(CLK)
Netfiltro2_3: filtro2.3(OP_OUT) filtro2.4(OP_IN-)
Netfiltro2_5: filtro2.5(OUT) ; port Signal_out_fil2
Netfiltro2_8: filtro2.8(IN) ; port Signal_in_fil2

### Library data of the parts
C1-F2 C2-F2 C3-F2 C4-F2 C5-F2 C6-F2 C7-F2 C8-F2 C9-F2 C10-F2 Ccoup-F2a Ccoup-F2b = CAP
fcSelector-F2 = SW DIP-6: DIP Switch, 6 Position, SPST; Published: 24-Mar-1999; LatestRevisionDate: 17-Jul-2002; LatestRevisionNote: Re-released for DXP Platform.; PackageReference: DIP-12/SW; Publisher: Altium Limited; PackageDescription: DIP Switch; 12 Leads
filtro2 = MAX297CPA+: as U1 on sheet filtro; DatasheetVersion: Rev. 2; PackageVersion: Rev. E, 04/2011; PackageReference: P8+2; PackageDescription: 8-Pin Plastic Dual-In-Line, Narrow (0.3in) (P8+2), Body 9.375 x 6.985 mm, Pitch 2.54 mm; Supplier 1: Digi-Key; Supplier Part Number 1: MAX297CPA+-ND; Supplier 2: Mouser; Supplier Part Number 2: 700-MAX297CPA; Filter Characteristic: Elliptic; Filter Class: Switched Cap; Filter Type: Lowpass; RoHS: Pb-Free; Mounting Technology: Through Hole; Code_JEDEC: MS001-XX; PartNumber: MAX297CPA+; ComponentLink1Description: Manufacturer URL; ComponentLink1URL: http://www.maximintegrated.com/; ComponentLink2Description: Datasheet; ComponentLink2URL: http://datasheets.maximintegrated.com/en/ds/MAX293-MAX297.pdf; ComponentLink3Description: Package Specification; ComponentLink3URL: http://pdfserv.maximintegrated.com/package_dwgs/21-0043.PDF

## Nets that join several sheets
+5V: Placa_ADA (19 pins), ADC (5 pins), Leds (Latch_leds.20 LedDriver1.20), filtro (Ccoup1-Filter.2 U1.7), offset (D1OFF.2), filtro2 (Ccoup-F2a.2 filtro2.7)
+15V: Placa_ADA (ADA_Opamp.8 Ccoupvcc1.1 DAC_ADA.13 U_15V.3), ADC (7 pins), offset (UOFF.8)
-5V: Placa_ADA (Ccoupvcc7.1 U-5V.3), filtro (Ccoup2-Filter.2 U1.2), offset (R3.1), filtro2 (Ccoup-F2b.2 filtro2.2)
-15V: Placa_ADA (5 pins), ADC (C_comp_DAC.1 Ccoup2-S&H.1 DAC_fpga.3 S&H.4), offset (UOFF.4)
GND_ADC_net: Placa_ADA (43 pins), ADC (12 pins), Leds (18 pins), filtro (9 pins), offset (D2OFF.1 R4.1 R6.1), filtro2 (9 pins)
ADC_input_ADA: Placa_ADA (ADC_integrado.26), ADC (S&H.3), offset (D1OFF.1 D2OFF.2 R1.1 UOFF.7)
CLK0: Placa_ADA (CLK_RES0.1 ClockSwitch.16), ADC (FPGA.1)
CLK1: Placa_ADA (CLK_RES1.1 ClockSwitch.15), ADC (FPGA.3)
CLK2: Placa_ADA (CLK_RES2.1 ClockSwitch.14), ADC (FPGA.5)
CLK3: Placa_ADA (CLK_RES3.1 ClockSwitch.13), ADC (FPGA.7)
CLK4: Placa_ADA (CLK_RES4.1 ClockSwitch.12), ADC (FPGA.9)
CLK5: Placa_ADA (CLK_RES5.1 ClockSwitch.11), ADC (FPGA.11)
CLK6: Placa_ADA (CLK_RES6.1 ClockSwitch.10), ADC (FPGA.13)
CLK7: Placa_ADA (CLK_RES7.1 ClockSwitch.9), ADC (FPGA.15)
D1_ADA: Placa_ADA (ADC_integrado.21), ADC (R_ADC_D1.1), Leds (Latch_leds.3)
D2_ADA: Placa_ADA (ADC_integrado.20), ADC (R_ADC_D2.1), Leds (Latch_leds.4)
D3_ADA: Placa_ADA (ADC_integrado.19), ADC (R_ADC_D3.1), Leds (Latch_leds.7)
D4_ADA: Placa_ADA (ADC_integrado.18), ADC (R_ADC_D4.1), Leds (Latch_leds.8)
D5_ADA: Placa_ADA (ADC_integrado.8), ADC (R_ADC_D5.1), Leds (Latch_leds.13)
D6_ADA: Placa_ADA (ADC_integrado.15), ADC (R_ADC_D6.1), Leds (Latch_leds.14)
D7_ADA: Placa_ADA (ADC_integrado.14), ADC (R_ADC_D7.1), Leds (Latch_leds.17)
D8_ADA: Placa_ADA (ADC_integrado.17), ADC (R_ADC_D8.1), Leds (Latch_leds.18)
Delta/SAR: Placa_ADA (Oe_Schmitt_trigger.6), ADC (PinsAdicionales_FPGA.1)
L1: Placa_ADA (DAC_ADA.5), Leds (LedDriver1.2 R_de_TaxiDriver1.1 SwitchesLEDS.16)
L2: Placa_ADA (DAC_ADA.6), Leds (LedDriver1.4 R_de_TaxiDriver2.1 SwitchesLEDS.15)
L3: Placa_ADA (DAC_ADA.7), Leds (LedDriver1.6 R_de_TaxiDriver3.1 SwitchesLEDS.14)
L4: Placa_ADA (DAC_ADA.8), Leds (LedDriver1.8 R_de_TaxiDriver4.1 SwitchesLEDS.13)
L5: Placa_ADA (DAC_ADA.9), Leds (LedDriver1.11 R_de_TaxiDriver5.1 SwitchesLEDS.12)
L6: Placa_ADA (DAC_ADA.10), Leds (LedDriver1.13 R_de_TaxiDriver6.1 SwitchesLEDS.11)
L7: Placa_ADA (DAC_ADA.11), Leds (LedDriver1.15 R_de_TaxiDriver7.1 SwitchesLEDS.10)
L8: Placa_ADA (DAC_ADA.12), Leds (LedDriver1.17 R_de_TaxiDriver8.1 SwitchesLEDS.9)
Netfiltro2_5: Placa_ADA (JF2Out.1), filtro2 (filtro2.5)
Netfiltro2_8: Placa_ADA (JF2In.3), filtro2 (filtro2.8)
NetJFIn_3: Placa_ADA (JFIn.3), filtro (U1.8)
NetJFOut_1: Placa_ADA (JFOut.1), filtro (U1.5)
NetJFOut_2: Placa_ADA (JFOut.2), offset (R5.2)
NewStartADA: Placa_ADA (R_NewStart.1), ADC (PinsAdicionales_FPGA.4), Leds (Latch_leds.11)
OE_fpga_sel: Placa_ADA (Jumper_FPGA/Integrado.1 OE_PulldownADC_R1.2), ADC (PinsAdicionales_FPGA.3)
OE_negado: Placa_ADA (Oe_Schmitt_trigger.2 Oe_Schmitt_trigger.3), Leds (Latch_leds.1 LedDriver1.1 LedDriver1.19)
StartADA: Placa_ADA (ADC_integrado.6 Oe_Schmitt_trigger.10), ADC (FPGA.17)